# Altium schematic sheet txpreamp6.SchDoc: mcHF QRP Transceiver RF board
size A4; Author: K Atanassov; CompanyName: M0NKA; Revision: 0.6.3; SheetTotal: 12
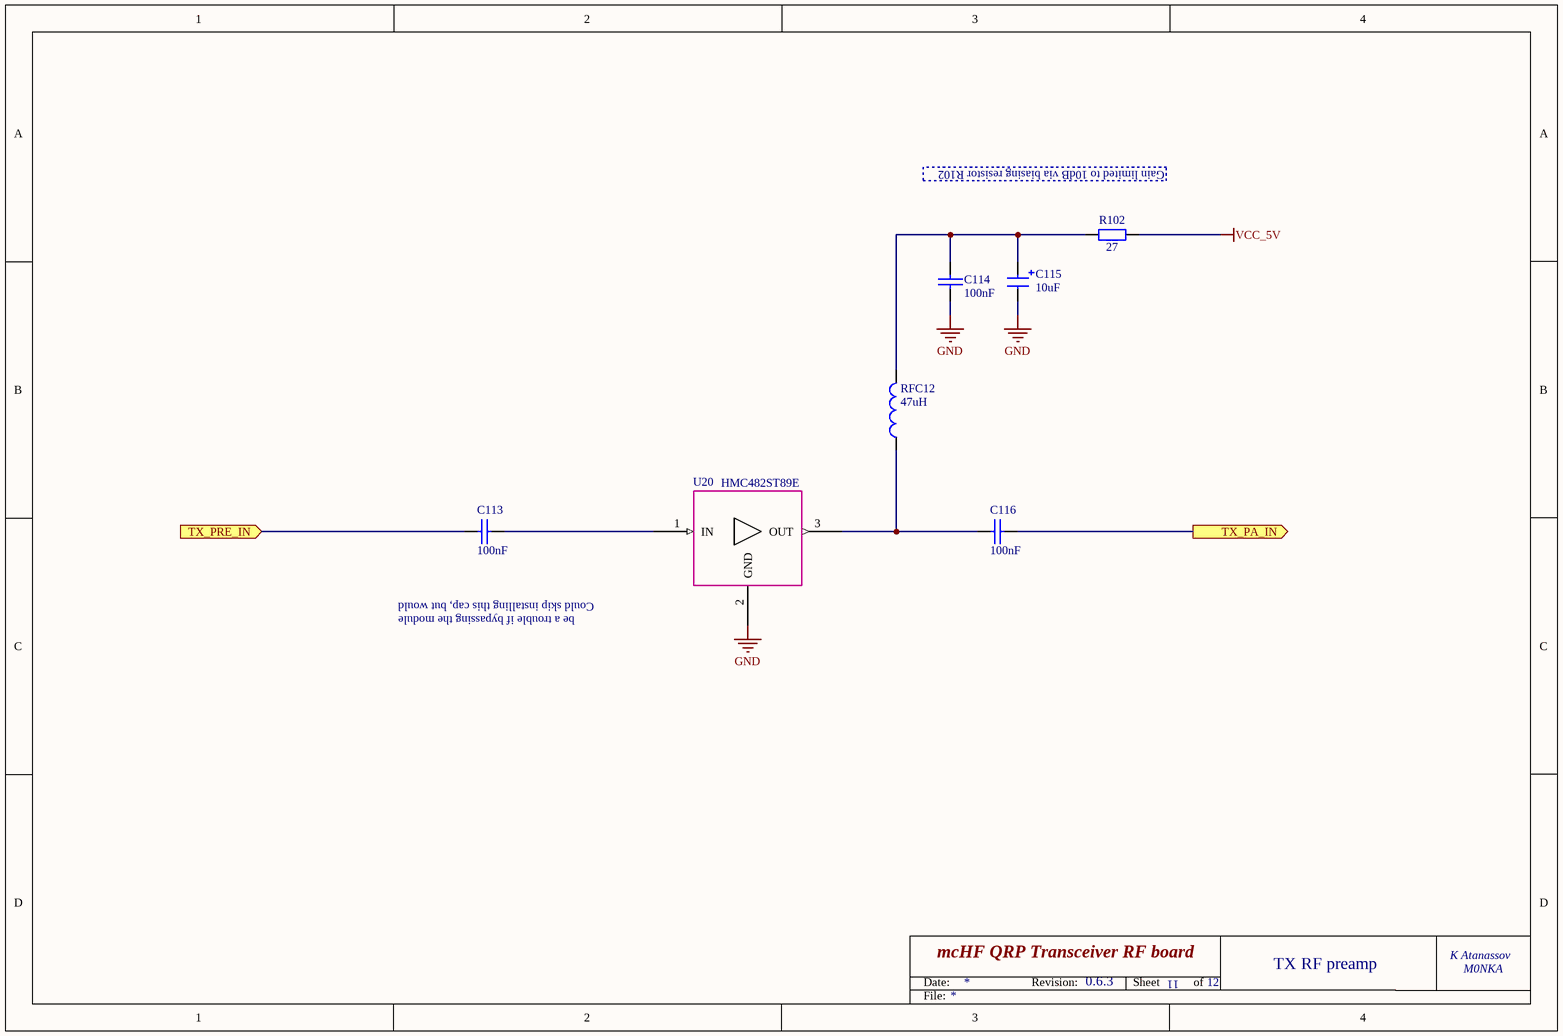
[diagram p0: txpreamp6.SchDoc]

## Parts
C113  100nF  [0805-Pro]
C114  100nF  [0805-Pro]
C115  10uF  [1206_Elec_Cap_N]
C116  100nF  [0805-Pro]
R102  27  [1206]
RFC12  47uH  [0805-Pro]
U20  HMC482ST89E  [SOT89L_new]

## Ports
TX_PA_IN (out), TX_PRE_IN (in)

## Nets
GND: C114.2 C115.2 U20.2(GND)
VCC_5V: R102.1
TX_PA_IN: C116.1 ; port TX_PA_IN
TX_PRE_IN: C113.2 ; port TX_PRE_IN
NetC113_1: C113.1 U20.1(IN)
NetC114_1: C114.1 C115.1 R102.2 RFC12.2
NetC116_2: C116.2 RFC12.1 U20.3(OUT)

## Notes on the sheet
- Gain limited to 10dB via biasing resistor R102
- Could skip installing this cap, but would
- be a trouble if bypassing the module
- 11
- TX RF preamp
- Date:
- Revision:
- Sheet
- of
- File:

## Library data of the parts
C113 C114 C116 = CAP: Capacitor; Order: FN 252-2090; QT Order: QCC-00154; Price: 0.068
C115 = CAP-POL: Electrolitic capacitor; Order: FN 233-3009; QT Order: QCC-00166; Price: 0.204
R102 = RES: Resistor; Order: FN 205-7802; QT Order: QCR-00427; Price: 0.017
RFC12 = TDK-NLV25T: INDUCTOR, SIGNAL LINE, 4.7UH, 1005; Order: FN 166-9895; Price: 0.166
U20 = HMS482ST89E: MMIC AMPLIFIER; Order: FN 245-6527; Price: 2.82